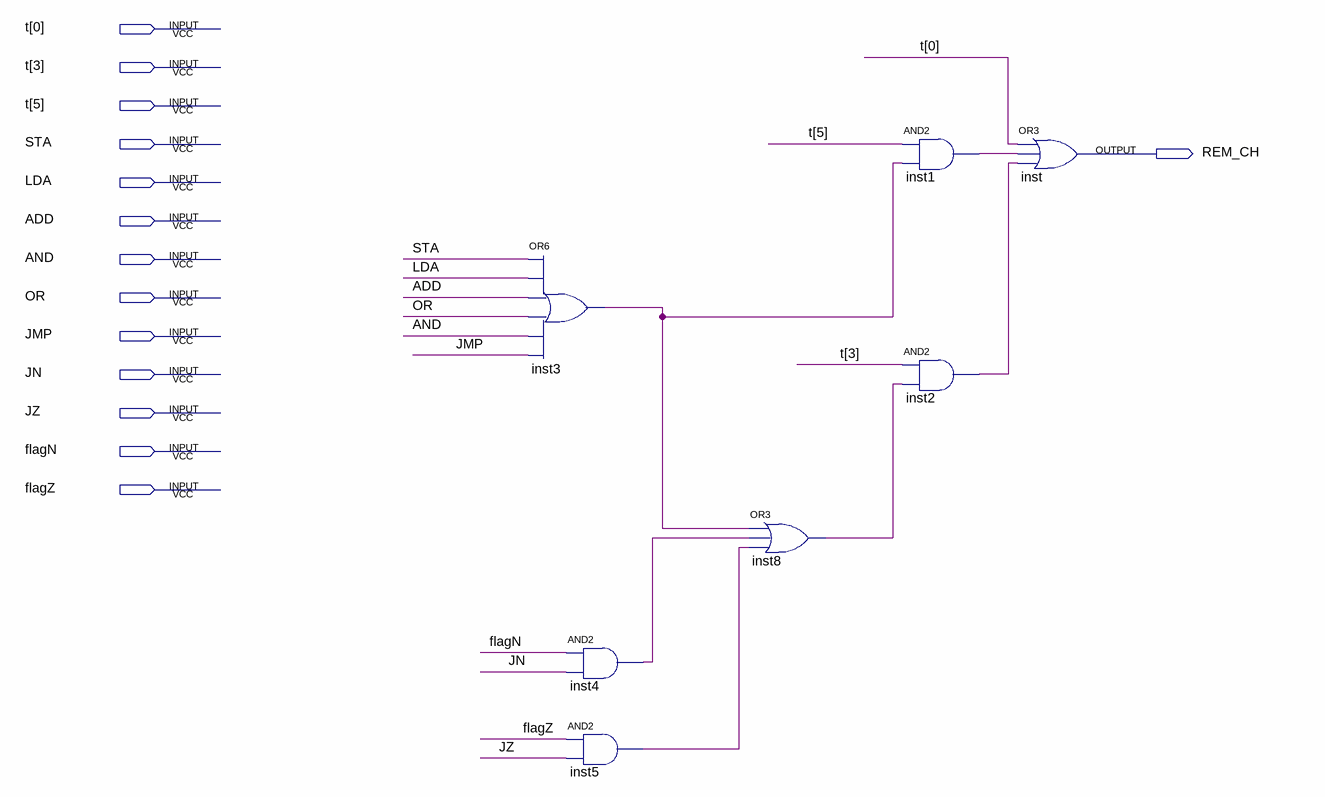
[diagram p0: schematic sheet]
// Quartus schematic REM_CH_LOGIC.bdf as structural Verilog: 7 symbols, 14 pins
module REM_CH_LOGIC (
  input  [5:0] t,
  input  STA,
  input  LDA,
  input  ADD,
  input  AND,
  input  OR,
  input  JMP,
  input  JN,
  input  JZ,
  input  flagN,
  input  flagZ,
  output REM_CH
);

  wire inst1_out, inst2_out, inst3_out, inst4_out, inst5_out, inst8_out;

  or inst3 (inst3_out, STA, LDA, ADD, OR, AND, JMP);
  and inst4 (inst4_out, flagN, JN);
  and inst5 (inst5_out, flagZ, JZ);
  or inst8 (inst8_out, inst3_out, inst4_out, inst5_out);
  and inst1 (inst1_out, t[5], inst3_out);
  and inst2 (inst2_out, t[3], inst8_out);
  or inst (REM_CH, t[0], inst1_out, inst2_out);
endmodule
